# EAGLE schematic Mosquito2 (EAGLE 6.4)
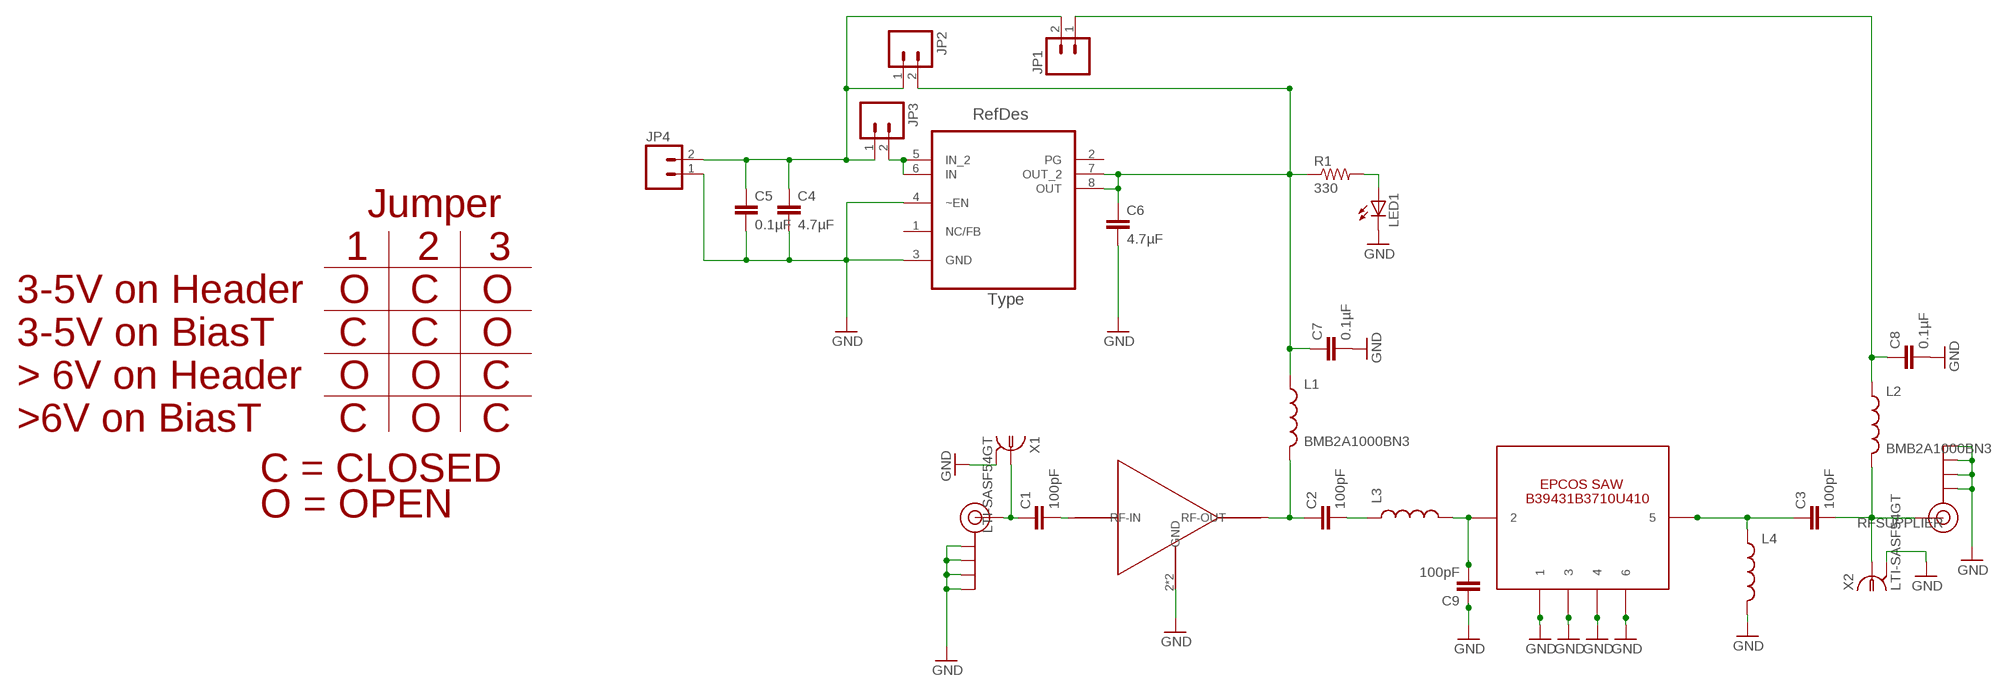
[diagram p0: schematic, sheet 1]

## Parts
C1  100pF  CAP0603-CAP  [0603-CAP]
C2  100pF  CAP0603-CAP  [0603-CAP]
C3  100pF  CAP0603-CAP  [0603-CAP]
C4  4.7µF  CAP0805  [0805]
C5  0.1µF  CAP0603-CAP  [0603-CAP]
C6  4.7µF  CAP0805  [0805]
C7  0.1µF  CAP0603-CAP  [0603-CAP]
C8  0.1µF  CAP0603-CAP  [0603-CAP]
C9  100pF  CAP0603-CAP  [0603-CAP]
IN  SMA_EDGE  [SMA-EDGE]
JP1  M02PTH  [1X02]
JP2  M02PTH  [1X02]
JP3  M02PTH  [1X02]
JP4  M02PTH  [1X02]
L1  BMB2A1000BN3  INDUCTOR0805  [0805]
L2  BMB2A1000BN3  INDUCTOR0805  [0805]
L3  INDUCTOR0603  [0603]
L4  INDUCTOR0603  [0603]
LED1  LEDCHIP-LED0603  [CHIP-LED0603]
OUT  SMA_EDGE  [SMA-EDGE]
R1  330  RESISTOR0402-RES  [0402-RES]
U1  TPS76633D  [SOIC127P600X175-8N]
U$1  AVA_EPCOS_SAW_FILTER  [AVA_EPCOS_SAW_FILTER]
U$2  PSA4-5043+  [PSA4-5043+]
X1  LTI-SASF54GT  [LTI-SASF54GT]
X2  LTI-SASF54GT  [LTI-SASF54GT]

## Nets
GND: C4.2 C5.2 C6.2 C7.2 C8.2 C9.1 IN.GND@0(GND) IN.GND@1(GND) IN.GND@2(GND) IN.GND@3(GND) JP4.1 L4.2 LED1.C OUT.GND@0(GND) OUT.GND@1(GND) OUT.GND@2(GND) OUT.GND@3(GND) U1.3(GND) U1.4(~EN) U$1.P$1 U$1.P$3 U$1.P$4 U$1.P$6 U$2.2(GND) U$2.4(GND) X1.2 X1.3 X1.4 X1.5 X2.2 X2.3 X2.4 X2.5
N$1: C1.1 IN.SIG(SIGNAL) X1.1
N$2: C1.2 U$2.3(RF-IN)
N$3: C4.1 C5.1 JP1.2 JP2.1 JP3.1 JP4.2
N$4: C2.1 L1.2 U$2.1(RF-OUT)
N$5: C2.2 L3.1
N$6: C3.2 L2.2 OUT.SIG(SIGNAL) X2.1
N$7: LED1.A R1.2
N$8: C8.1 JP1.1 L2.1
N$9: C6.1 C7.1 JP2.2 L1.1 R1.1 U1.7(OUT_2) U1.8(OUT)
N$10: JP3.2 U1.5(IN_2) U1.6(IN)
N$11: C3.1 L4.1 U$1.P$5
N$12: C9.2 L3.2 U$1.P$2
Unconnected: U1.1(NC/FB) U1.2(PG)

## Notes on the sheet
- Jumper
- 1 | 2 | 3
- 3-5V on Header | O | C | O
- 3-5V on BiasT | C | C | O
- > 6V on Header | O | O | C
- >6V on BiasT | C | O | C
- C = CLOSED
- O = OPEN

## Library data of the parts
C1-C9 = SparkFun:CAP: Capacitor Standard 0603 ceramic capacitor, and 0.1" leaded capacitor.
IN = SparkFun:SMA_EDGE: SMA Antenna Connector End launch SMA connector. The paste layer has been removed so that the connector can be hand soldered onto the board after reflow.; RFSUPPLIER: http://www.rfsupplier.com/hole-panel-mount-jack-with-solder-post-terminal-p-2365.html
JP1-JP4 = SparkFun:M02: Header 2 Standard 2-pin 0.1" header. Use with straight break away headers (SKU : PRT-00116), right angle break away headers (PRT-00553), swiss pins (PRT-00743), machine pins (PRT-00117), and female headers (PRT-00115). Molex polarized connector foot print use with SKU : PRT-08233 with associated crimp pins and housings.
L1 L2 = SparkFun:INDUCTOR: Inductors Basic Inductor/Choke - 0603 and 1206. Footprints are not proven and vary greatly between part numbers.
L3 L4 = SparkFun-Passives:INDUCTOR: Inductors Basic Inductor/Choke - 0603 and 1206. Footprints are not proven and vary greatly between part numbers.
LED1 = adafruit:LED: LED OSRAM: - CHIPLED LG R971, LG N971, LY N971, LG Q971, LY Q971, LO R971, LY R971 LH N974, LH R974 LS Q976, LO Q976, LY Q976 LO Q996 - Hyper CHIPLED LW Q18S LB Q993, LB Q99A, LB R99A - SideLED LS A670, LO A670, LY A670, LG A670, LP A670 LB A673, LV A673, LT A673, LW A673 LH A674 LY A675 LS A676, LA A676, LO A676, LY A676, LW A676 LS A679, LY A679, LG A679 - Hyper Micro SIDELED® LS Y876, LA Y876, LO Y876, LY Y876 LT Y87S - SmartLED LW L88C, LW L88S LB L89C, LB L89S, LG L890 LS L89K, LO L89K, LY L89K LS L896, LA L896, LO L896, LY L896 - TOPLED LS T670, LO T670, LY T670, LG T670, LP T670 LSG T670, LSP T670, LSY T670, LOP T670, LYG T670 LG T671, LOG T671, LSG T671 LB T673, LV T673, LT T673, LW T673 LH T674 LS T676, LA T676, LO T676, LY T676, LB T676, LH T676, LSB T676, LW T676 LB T67C, LV T67C, LT T67C, LS T67K, LO T67K, LY T67K, LW E67C LS E67B, LA E67B, LO E67B, LY E67B, LB E67C, LV E67C, LT E67C LW T67C LS T679, LY T679, LG T679 LS T770, LO T770, LY T770, LG T770, LP T770 LB T773, LV T773, LT T773, LW T773 LH T774 LS E675, LA E675, LY E675, LS T675 LS T776, LA T776, LO T776, LY T776, LB T776 LHGB T686 LT T68C, LB T68C - Hyper Mini TOPLED® LB M676 - Mini TOPLED Santana® LG M470 LS M47K, LO M47K, LY M47K Source: http://www.osram.convergy.de/
OUT = SparkFun:SMA_EDGE: SMA Antenna Connector End launch SMA connector. The paste layer has been removed so that the connector can be hand soldered onto the board after reflow.; RFSUPPLIER: http://www.rfsupplier.com/hole-panel-mount-plug-with-solder-post-terminal-short-vers-p-1731.html
R1 = SparkFun-Passives:RESISTOR: Resistor Basic schematic elements and footprints for 0603, 1206, and PTH resistors.
U1 = Ava:TPS76633D; DESCRIPTION: ULTRALOW QUIESCENT CURRENT 250-mA LOW DROPOUT VOLTAGE REGULATORS; MPN: TPS76633D; OC_FARNELL: 8461422; OC_NEWARK: 77C1060; PACKAGE: SOIC-8; SUPPLIER: Texas Instruments
U$1 = HabAmp.lbrHAMAmp2.1:AVA_EPCOS_SAW_FILTER
U$2 = Ava:PSA4-5043+
X1 X2 = con-coax:LTI-SASF54GT: SMA vertical PCB thrue hole jack Source: Lighthorse Technologies, inc. SASF54GT.pdf; OC_FARNELL: unknown; OC_NEWARK: unknown